# Altium project 5VBoost_4_Newton.PrjPcb
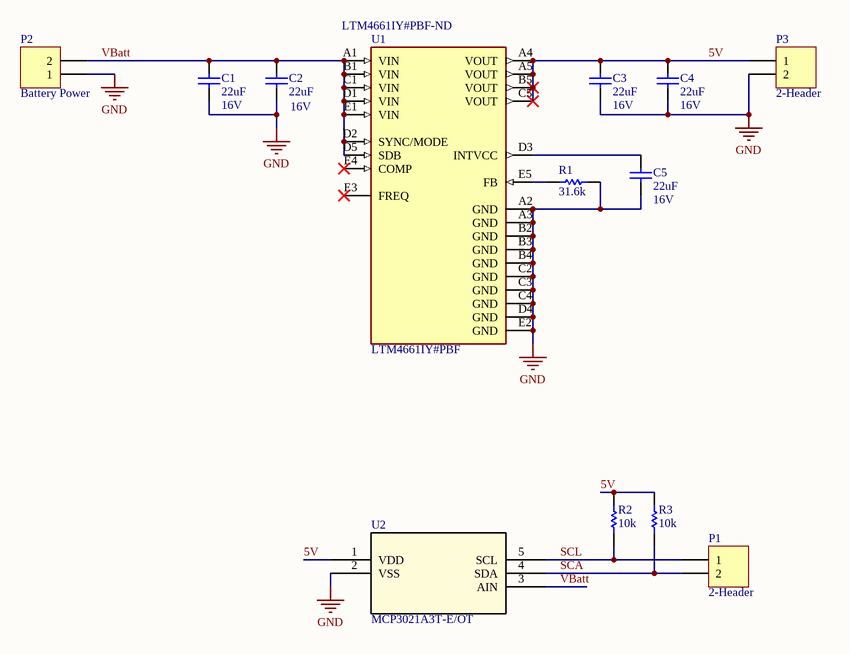
[diagram p0: 5VBoost.SchDoc]
1 sheet, 13 parts. Net scope: global (net labels, ports and power ports of the same name join across sheets).
Board file: 5VBoost.PcbDoc

## Sheet 5VBoost.SchDoc
size A4

### Parts
C1  22uF  value 16V  [1608[0603]]
C2  22uF  value 16V  [1608[0603]]
C3  22uF  value 16V  [1608[0603]]
C4  22uF  value 16V  [1608[0603]]
C5  22uF  value 16V  [1608[0603]]
P1  2-Header  [HDR1X2]
P2  Battery Power  [xt30 right angle]
P3  2-Header  [HDR1X2]
R1  31.6k  [1608[0603]]
R2  10k  [1608[0603]]
R3  10k  [1608[0603]]
U1  LTM4661IY#PBF  Supplier Part Number 1: LTM4661IY#PBF-ND  [BGA25C127P5X5_625X625X262N]
U2  MCP3021A3T-E/OT  [SOT-23-5_MC_MCH]

### Nets
GND: C1.1 C2.1 C3.1 C4.1 C5.2 P2.1 P3.2 R1.1 U1.A2(GND) U1.A3(GND) U1.B2(GND) U1.B3(GND) U1.B4(GND) U1.C2(GND) U1.C3(GND) U1.C4(GND) U1.D4(GND) U1.E2(GND) U2.2(VSS)
5V: C3.2 C4.2 P3.1 R2.2 R3.2 U1.A4(VOUT) U1.A5(VOUT) U1.B5(VOUT) U1.C5(VOUT) U2.1(VDD)
SCA: P1.2 R3.1 U2.4(SDA)
SCL: P1.1 R2.1 U2.5(SCL)
VBatt: C1.2 C2.2 P2.2 U1.A1(VIN) U1.B1(VIN) U1.C1(VIN) U1.D1(VIN) U1.D2(SYNC/MODE) U1.D5(SDB) U1.E1(VIN) U2.3(AIN)
NetC5_1: C5.1 U1.D3(INTVCC)
NetR1_2: R1.2 U1.E5(FB)

Not connected (* = marked no-connect by the designer): U1 E3(FREQ)* E4(COMP)*

### Library data of the parts
C1-C5 = Cap: Capacitor; Published: 8-Jun-2000; LatestRevisionDate: 17-Jul-2002; LatestRevisionNote: Re-released for DXP Platform.; PackageReference: RAD-0.3; Publisher: Altium Limited; PackageDescription: Radial Cap, Thru-Hole; 2 Leads; 0.3 in Pin Spacing
P1-P3 = Header 2: Header, 2-Pin; LatestRevisionDate: 17-Jul-2002; LatestRevisionNote: Re-released for DXP Platform.; Publisher: Altium Limited
R1-R3 = Res1: Resistor; Published: 8-Jun-2000; LatestRevisionDate: 17-Jul-2002; LatestRevisionNote: Re-released for DXP Platform.; PackageReference: AXIAL-0.3; Publisher: Altium Limited; PackageDescription: Axial Device, Thru-Hole; 2 Leads; 0.3 in Pin Spacing
U1 = LTM4661IY#PBF: Conv DC-DC 0.7V to 5.5V Step Up Single-Out 2.5V to 15V 2A uModule 25-Pin BGA Tray; MF: Analog Devices; Availability: Unavailable; Package: BGA -25 Analog Devices; SnapEDA_Link: https://www.snapeda.com/parts/LTM4661IY%23PBF/Analog%20Devices/view-part/4341307/?ref=snap; MP: LTM4661IY#PBF; Price: None; Value: *; Supplier 1: Digi-Key
U2 = MCP3021A3T-E/OT: No Description Available; Vendor: Microchip; Built_By: EMA_Jessica; SourceLibrary: Microchip_2019-08-23_6; Manufacturer_Part_Number: MCP3021A3T-E/OT; Copyright: Copyright (C) 2018 Accelerated Designs. All rights reserved; RefDes: RefDes; Type: DEV